# EAGLE design display (EAGLE 7.2.0)
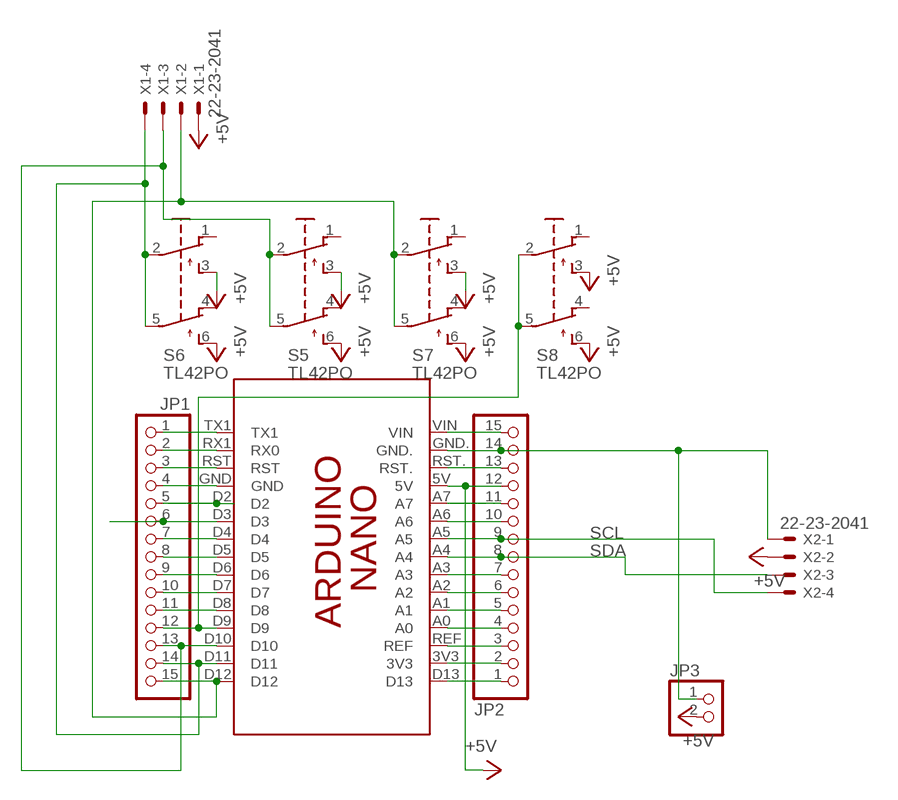
[diagram p0: schematic, sheet 1]

## Parts
JP1  PINHD-1X15  [1X15]
JP2  PINHD-1X15  [1X15]
JP3  PINHD-1X2  [1X02]
PCB1  ARDUINO_NANO  [ARDUINO_NANO]
S5  TL42PO  [TL4XPO]
S6  TL42PO  [TL4XPO]
S7  TL42PO  [TL4XPO]
S8  TL42PO  [TL4XPO]
X1  22-23-2041  [22-23-2041]
X2  22-23-2041  [22-23-2041]

## Nets
+5V: JP2.12 JP3.2 PCB1.5V S5.3(S) S5.6(S1) S6.3(S) S6.6(S1) S7.3(S) S7.6(S1) S8.3(S) S8.6(S1) X1.1 X2.2
GND: JP2.14 JP3.1 PCB1.GND. X2.1
N$2: JP1.13 PCB1.D10 S5.2(P) S5.5(P1) X1.3
N$3: JP1.15 PCB1.D12 S7.2(P) S7.5(P1) X1.2
N$4: JP1.1 PCB1.TX1
N$5: JP1.2 PCB1.RX1(RX0)
N$6: JP1.3 PCB1.RST
N$7: JP1.4 PCB1.GND
N$8: JP1.5 PCB1.D2
N$9: JP1.6 PCB1.D3
N$10: JP1.7 PCB1.D4
N$11: JP1.8 PCB1.D5
N$12: JP1.9 PCB1.D6
N$13: JP1.10 PCB1.D7
N$14: JP1.11 PCB1.D8
N$15: JP1.12 PCB1.D9 S8.2(P) S8.5(P1)
N$17: JP1.14 PCB1.D11 S6.2(P) S6.5(P1) X1.4
N$19: JP2.15 PCB1.VIN
N$21: JP2.13 PCB1.RST.
N$23: JP2.11 PCB1.A7
N$24: JP2.10 PCB1.A6
N$27: JP2.7 PCB1.A3
N$28: JP2.6 PCB1.A2
N$29: JP2.5 PCB1.A1
N$30: JP2.4 PCB1.A0
N$31: JP2.2 PCB1.3V3
N$32: JP2.3 PCB1.REF
N$33: JP2.1 PCB1.D13
SCL: JP2.9 PCB1.A5 X2.4
SDA: JP2.8 PCB1.A4 X2.3
Unconnected: S5.1(O) S5.4(O1) S6.1(O) S6.4(O1) S7.1(O) S7.4(O1) S8.1(O) S8.4(O1)

## Library data of the parts
JP1 JP2 = pinhead:PINHD-1X15: PIN HEADER
JP3 = pinhead:PINHD-1X2: PIN HEADER
PCB1 = E14_Arduino_revB:ARDUINO_NANO: Device for representing an Arduino Nano board with a footprint in an EAGLE design. Created by Dave Young for Element14. More EAGLE documentation at: http://www.element14.com/community/community/knode/cadsoft_eagle
S5-S8 = switch:TL42PO: TINY SWITCH ON - MOM Source: http://www2.produktinfo.conrad.com/datenblaetter/700000-724999/705152-da-01-de-Subminiaturschalter_TL_36YO.pdf
X1 X2 = con-molex:22-23-2041: .100" (2.54mm) Center Header - 4 Pin; MF: MOLEX; MPN: 22-23-2041; OC_FARNELL: 1462920; OC_NEWARK: 38C0355

## Board
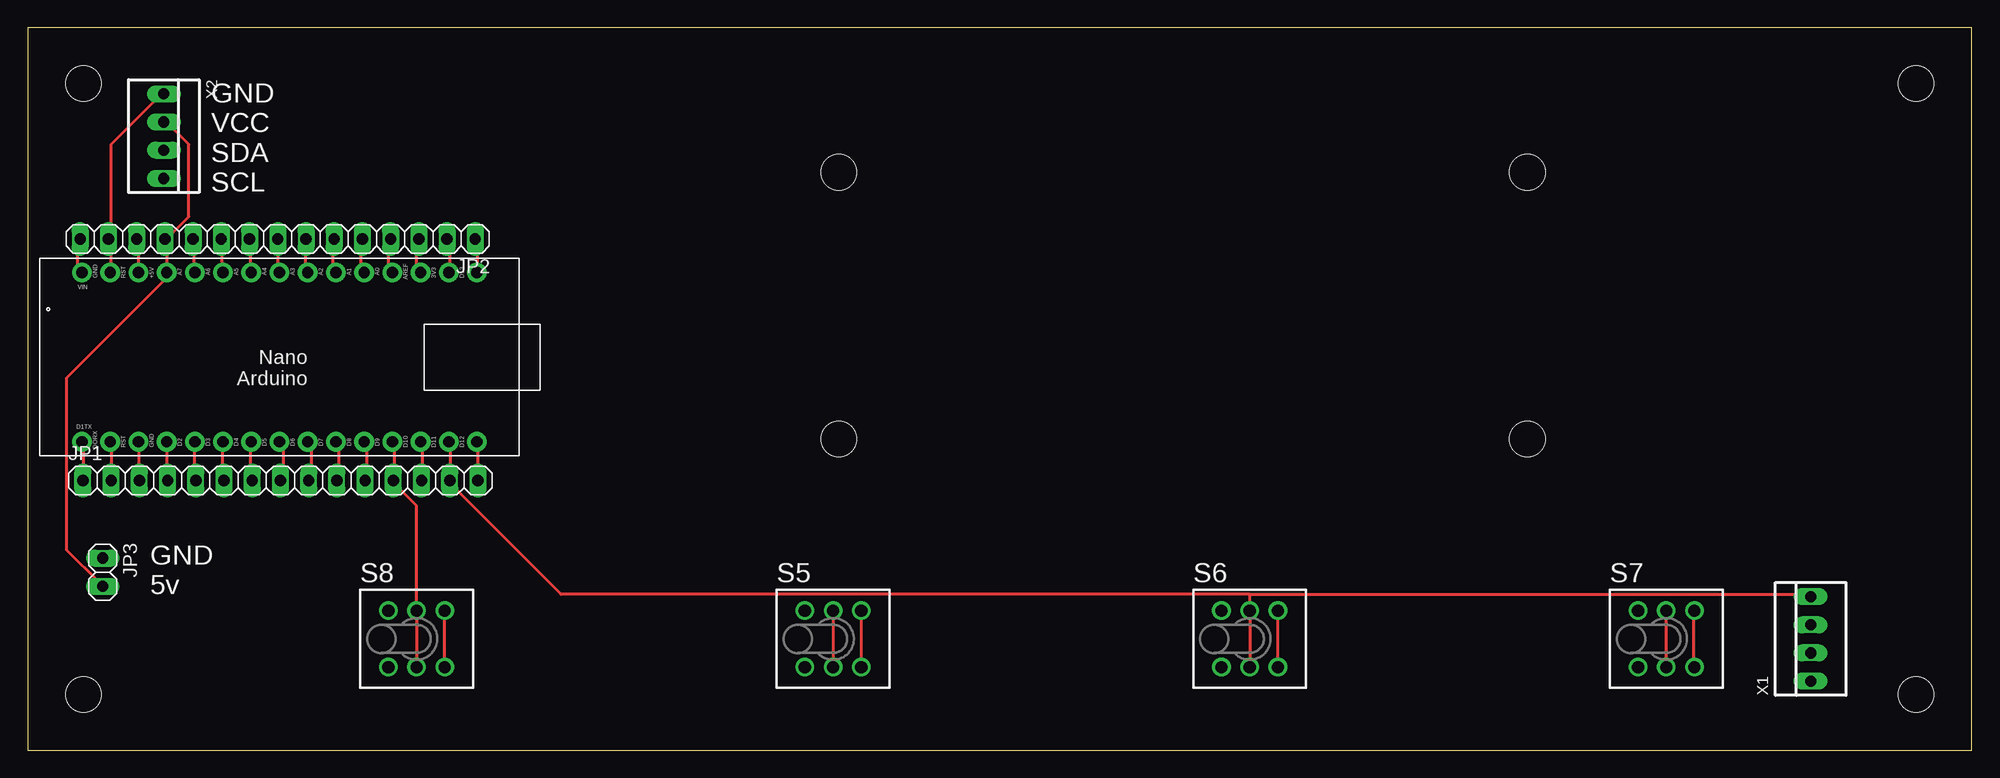
[diagram p1: board, top side]
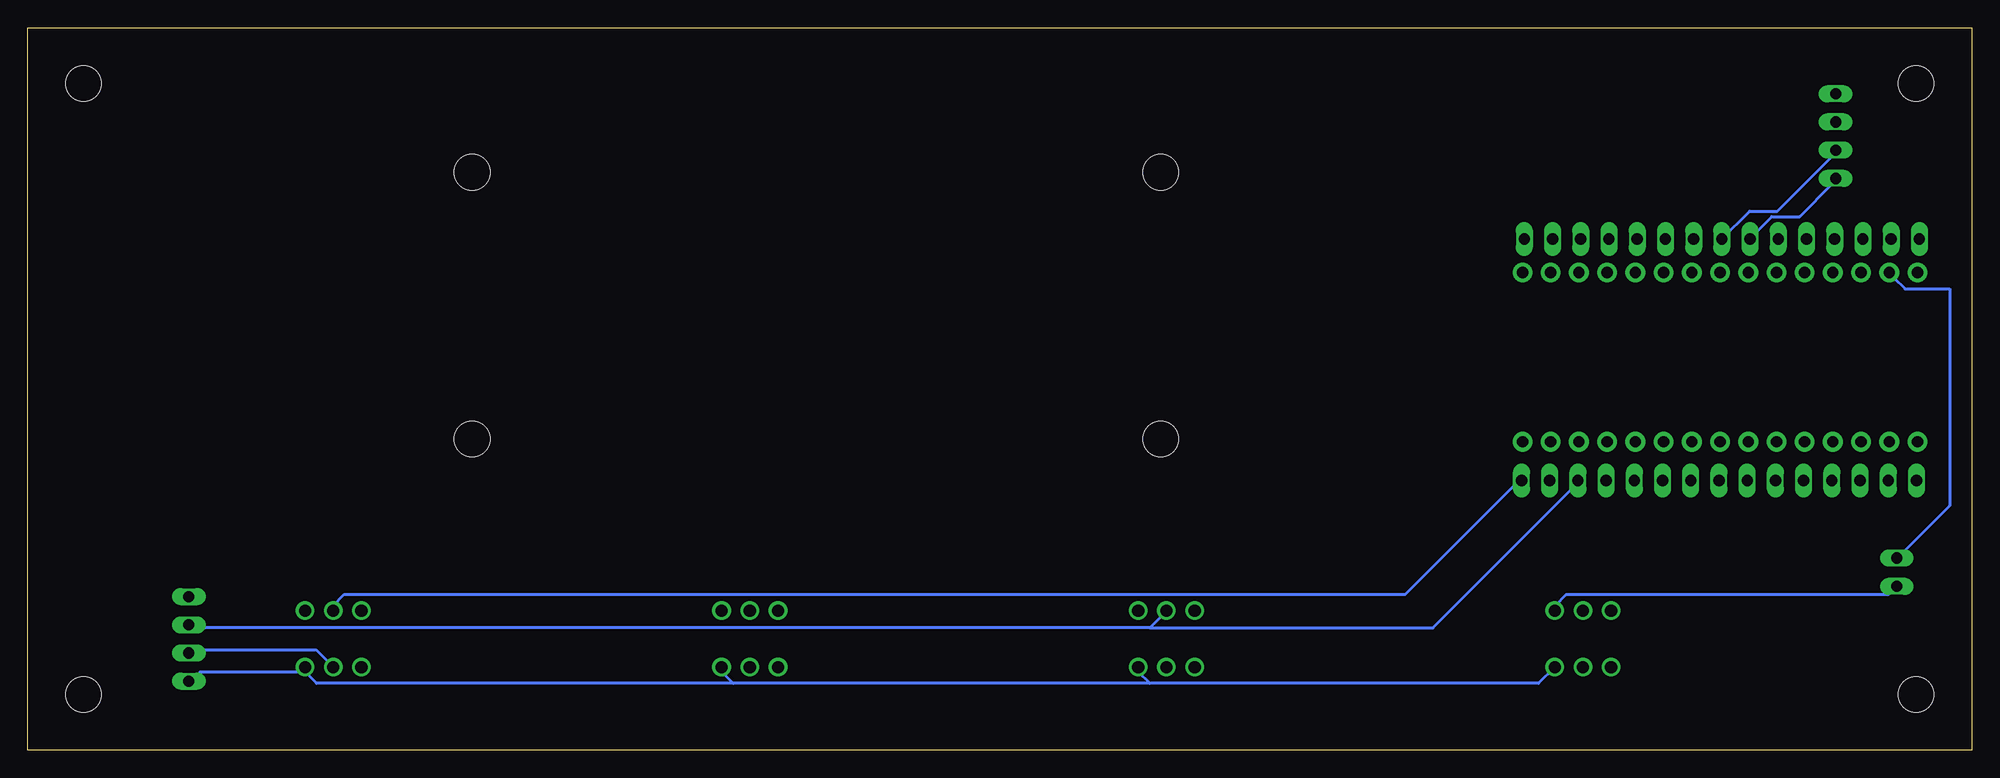
[diagram p2: board, bottom side, seen from below]

Size 175 x 65 mm. Coordinates in mm from the lower left corner, seen from the top.
Outline: 0,0 175,0 175,65 0,65 0,0
Copper layers (1*16): Top 0.035mm / dielectric 1.5mm / Bottom 0.035mm
Design rules "default": minimum track width 10mil, minimum drill 24mil, track to track 8mil, track to pad 8mil, pad to pad 8mil, via to via 8mil, smd to smd 8mil, copper to edge 40mil, drill to drill 8mil, minimum pad ring 10mil, minimum via ring 8mil, stop-mask expansion 4mil, vias tented up to drill 0mil, thermal gap 10mil
Holes 3.2 mm at 5,5 5,60 170,5 170,60 73,28 135,28 135,52 73,52

### Footprints (pad centres in the part's own frame; a part is rotated, then mirrored left to right if it is on the bottom)
1X15 = drill 1.016 long: 1 -17.78,0; 2 -15.24,0; 3 -12.7,0; 4 -10.16,0; 5 -7.62,0; 6 -5.08,0; 7 -2.54,0; 8 0,0; 9 2.54,0; 10 5.08,0; 11 7.62,0; 12 10.16,0; 13 12.7,0; 14 15.24,0; 15 17.78,0
1X02 = drill 1.016 long: 1 -1.27,0; 2 1.27,0
ARDUINO_NANO = drill 1.016 pad 1.778: 3V3 6.35,1.27; 5V 31.75,1.27; A0 11.43,1.27; A1 13.97,1.27; A2 16.51,1.27; A3 19.05,1.27; A4 21.59,1.27; A5 24.13,1.27; A6 26.67,1.27; A7 29.21,1.27; D2 29.21,16.51; D3 26.67,16.51; D4 24.13,16.51; D5 21.59,16.51; D6 19.05,16.51; D7 16.51,16.51; D8 13.97,16.51; D9 11.43,16.51; D10 8.89,16.51; D11 6.35,16.51; D12 3.81,16.51; D13 3.81,1.27; GND 31.75,16.51; GND. 36.83,1.27; REF 8.89,1.27; RST 34.29,16.51; RST. 34.29,1.27; RX1 36.83,16.51; TX1 39.37,16.51; VIN 39.37,1.27
TL4XPO = drill 1.1 pad 1.676: 1 -2.54,2.54; 2 0,2.54; 3 2.54,2.54; 4 -2.54,-2.54; 5 0,-2.54; 6 2.54,-2.54
22-23-2041 = drill 1 long: 1 -3.81,0; 2 -1.27,0; 3 1.27,0; 4 3.81,0

### Placement (x,y rotation side)
JP1  22.75,24.25 0 top
JP2  22.5,46 180 top
JP3  6.75,16 270 top
PCB1  44.25,44.25 180 top
S5  72.5,10 0 top
S6  110,10 0 top
S7  147.5,10 0 top
S8  35,10 0 top
X1  160.5,10 90 top
X2  12.25,55.25 270 top

### Tracks (layer width: path | path; a pad name or v marks a point on that pad's centre or on a via)
+5V
  Top 0.254: S7.3 150,12.5 150,7.5 S7.6 | 12.5,46 14.5,48 14.5,54.5 12.5,56.5 X2.2 | 12.5,46 PCB1.5V 12.5,42.5 3.5,33.5 3.5,18 6.5,15 JP3.2 | 12.5,46 JP2.12 | S6.6 112.5,7.5 112.5,12.5 S6.3 | S5.6 75,7.5 75,12.5 S5.3 | S8.6 37.5,7.5 37.5,12.5 S8.3
  Bottom 0.254: JP3.2 7,14.5 7.5,14 36.5,14 37.5,13 S8.3 | 74,6 75,7 S5.6 | 74,6 39,6 S8.6 | 111.5,6 112.5,7 S6.6 | 74,6 111.5,6 | 111.5,6 149,6 150,7 S7.6 150.5,7 159.5,7 160,6.5 160.5,6.5 X1.1
GND
  Top 0.254: 7.5,46 7.5,54.5 12,59 X2.1 | 7.5,46 7.5,43 PCB1.GND. | 7.5,46 JP2.14
  Bottom 0.254: JP3.1 6.5,17.5 2,22 2,41.5 6,41.5 7,42.5 PCB1.GND.
N$2
  Top 0.254: JP1.13 35.5,24.5 35.5,27.5 PCB1.D10 | S5.2 S5.5
  Bottom 0.254: 74,11 159.5,11 160,11.5 160.5,11.5 X1.3 | 74,11 72.5,12.5 S5.2 | 74,11 48.5,11 35.5,24 JP1.13
N$3
  Top 0.254: JP1.15 40.5,24.5 40.5,27.5 PCB1.D12 | S7.5 S7.2
  Bottom 0.254: S7.5 147.5,7.5 149,9 160.5,9 X1.2 | JP1.15 41,24 51,14 146.5,14 147.5,13 S7.2
N$4
  Top 0.254: JP1.1 5,24.5 5,27.5 PCB1.TX1
N$5
  Top 0.254: JP1.2 7.5,24.5 7.5,27.5 PCB1.RX1
N$6
  Top 0.254: JP1.3 10,24.5 10,27.5 PCB1.RST
N$7
  Top 0.254: PCB1.GND 12.5,24.5 JP1.4
N$8
  Top 0.254: JP1.5 15,24.5 15,27.5 PCB1.D2
N$9
  Top 0.254: JP1.6 17.5,24.5 17.5,27.5 PCB1.D3
N$10
  Top 0.254: JP1.7 20,24.5 20,27.5 PCB1.D4
N$11
  Top 0.254: JP1.8 23,24.5 23,27.5 PCB1.D5
N$12
  Top 0.254: JP1.9 25.5,24.5 25.5,27.5 PCB1.D6
N$13
  Top 0.254: JP1.10 28,24.5 28,27.5 PCB1.D7
N$14
  Top 0.254: JP1.11 30.5,24.5 30.5,27.5 PCB1.D8
N$15
  Top 0.254: PCB1.D9 33,27.5 33,24.5 JP1.12 33,24 35,22 S8.2 S8.5
N$17
  Top 0.254: PCB1.D11 38,27.5 38,24.5 JP1.14 38,24 48,14 110,14 | 110,14 160.5,14 X1.4 | 110,14 S6.2 S6.5
N$19
  Top 0.254: JP2.15 4.5,46 4.5,43 PCB1.VIN
N$21
  Top 0.254: JP2.13 10,46 10,43 PCB1.RST.
N$23
  Top 0.254: JP2.11 15,46 15,43 PCB1.A7
N$24
  Top 0.254: JP2.10 17.5,46 17.5,43 PCB1.A6
N$27
  Top 0.254: JP2.7 25,46 25,43 PCB1.A3
N$28
  Top 0.254: JP2.6 27.5,46 27.5,43 PCB1.A2
N$29
  Top 0.254: JP2.5 30,46 30,43 PCB1.A1
N$30
  Top 0.254: JP2.4 32.5,46 32.5,43 PCB1.A0
N$31
  Top 0.254: JP2.2 38,46 38,43 PCB1.3V3
N$32
  Top 0.254: JP2.3 35,46 35,43 PCB1.REF
N$33
  Top 0.254: JP2.1 40.5,46 40.5,43 PCB1.D13
SCL
  Top 0.254: PCB1.A5 20,43 20,46 JP2.9
  Bottom 0.254: X2.4 12.5,51 15.5,48 18,48 20,46 JP2.9
SDA
  Top 0.254: JP2.8 22.5,43 PCB1.A4
  Bottom 0.254: JP2.8 20,48.5 17.5,48.5 12.5,53.5 X2.3

### Text on the board
tPlace: GND / VCC / SDA / SCL | GND / 5v